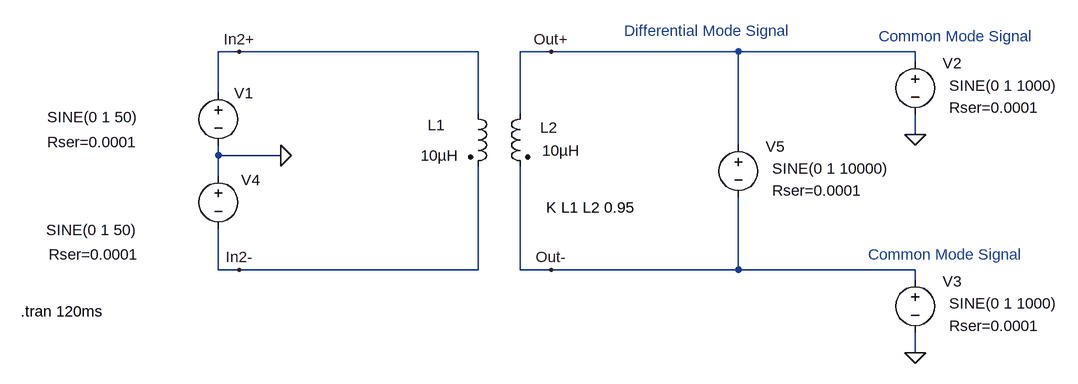
[diagram p0: schematic AC Power Flow ver 1.5.asc]
AC Power Flow ver 1.5.asc, the LTspice schematic file:
Version 4
SHEET 1 880 680
WIRE -704 -96 -736 -96
WIRE -336 -96 -704 -96
WIRE -224 -96 -272 -96
WIRE 64 -96 -224 -96
WIRE 336 -96 64 -96
WIRE 336 -80 336 -96
WIRE -736 -32 -736 -96
WIRE -336 0 -336 -96
WIRE -272 0 -272 -96
WIRE 336 32 336 0
WIRE 64 48 64 -96
WIRE -736 64 -736 48
WIRE -640 64 -736 64
WIRE -736 96 -736 64
WIRE -736 240 -736 176
WIRE -704 240 -736 240
WIRE -336 240 -336 80
WIRE -336 240 -704 240
WIRE -272 240 -272 80
WIRE -224 240 -272 240
WIRE 64 240 64 128
WIRE 64 240 -224 240
WIRE 336 240 64 240
WIRE 336 256 336 240
WIRE 336 368 336 336
FLAG -640 64 0
FLAG -704 -96 In2+
FLAG -704 240 In2-
FLAG -224 -96 Out+
FLAG -224 240 Out-
FLAG 336 32 0
FLAG 336 368 0
SYMBOL voltage -736 -48 R0
WINDOW 3 -263 53 Left 2
WINDOW 123 0 0 Left 2
WINDOW 39 -263 91 Left 2
SYMATTR Value SINE(0 1 50)
SYMATTR SpiceLine Rser=0.0001
SYMATTR InstName V1
SYMBOL voltage -736 80 R0
WINDOW 0 35 22 Left 2
WINDOW 3 -265 99 Left 2
WINDOW 123 0 0 Left 2
WINDOW 39 -261 136 Left 2
SYMATTR InstName V4
SYMATTR Value SINE(0 1 50)
SYMATTR SpiceLine Rser=0.0001
SYMBOL ind2 -352 -16 R0
WINDOW 0 -62 33 Left 2
WINDOW 3 -73 80 Left 2
SYMATTR InstName L1
SYMATTR Value 10µH
SYMATTR Type ind
SYMBOL ind2 -256 -16 M0
WINDOW 0 -42 37 Left 2
WINDOW 3 -76 72 Left 2
SYMATTR InstName L2
SYMATTR Value 10µH
SYMATTR Type ind
SYMBOL voltage 336 -96 R0
WINDOW 3 52 52 Left 2
WINDOW 123 0 0 Left 2
WINDOW 39 52 86 Left 2
WINDOW 0 42 18 Left 2
SYMATTR Value SINE(0 1 1000)
SYMATTR SpiceLine Rser=0.0001
SYMATTR InstName V2
SYMBOL voltage 336 240 R0
WINDOW 3 52 52 Left 2
WINDOW 123 0 0 Left 2
WINDOW 39 52 86 Left 2
WINDOW 0 42 18 Left 2
SYMATTR Value SINE(0 1 1000)
SYMATTR SpiceLine Rser=0.0001
SYMATTR InstName V3
SYMBOL voltage 64 32 R0
WINDOW 3 52 52 Left 2
WINDOW 123 0 0 Left 2
WINDOW 39 52 86 Left 2
WINDOW 0 42 18 Left 2
SYMATTR Value SINE(0 1 10000)
SYMATTR SpiceLine Rser=0.0001
SYMATTR InstName V5
TEXT -1040 304 Left 2 !.tran 120ms
TEXT -232 144 Left 2 !K L1 L2 0.95
TEXT 280 -120 Left 2 ;Common Mode Signal
TEXT 264 216 Left 2 ;Common Mode Signal
TEXT -112 -128 Left 2 ;Differential Mode Signal

The netlist it stands for:
* AC Power Flow ver 1.5.asc
V1 In2+ 0 SINE(0 1 50) Rser=0.0001
V4 0 In2- SINE(0 1 50) Rser=0.0001
L1 In2+ In2- 10µH
L2 Out+ Out- 10µH
V2 Out+ 0 SINE(0 1 1000) Rser=0.0001
V3 Out- 0 SINE(0 1 1000) Rser=0.0001
V5 Out+ Out- SINE(0 1 10000) Rser=0.0001
.tran 120ms
K L1 L2 0.95
* Common Mode Signal
* Common Mode Signal
* Differential Mode Signal
.backanno
.end